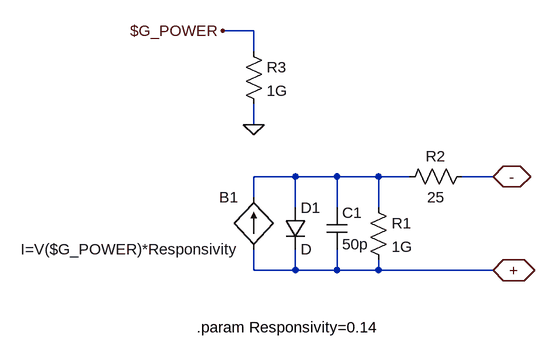
[diagram p0: schematic Photodiode.asc]
Photodiode.asc, the LTspice schematic file:
Version 4
SHEET 1 880 680
WIRE 160 -128 112 -128
WIRE 160 -96 160 -128
WIRE 160 16 160 -16
WIRE 224 96 160 96
WIRE 288 96 224 96
WIRE 352 96 288 96
WIRE 400 96 352 96
WIRE 528 96 480 96
WIRE 160 128 160 96
WIRE 224 144 224 96
WIRE 288 144 288 96
WIRE 352 144 352 96
WIRE 160 240 160 208
WIRE 224 240 224 208
WIRE 224 240 160 240
WIRE 288 240 288 208
WIRE 288 240 224 240
WIRE 352 240 352 224
WIRE 352 240 288 240
WIRE 528 240 352 240
FLAG 528 240 +
IOPIN 528 240 BiDir
FLAG 528 96 -
IOPIN 528 96 BiDir
FLAG 160 16 0
FLAG 112 -128 $G_POWER
SYMBOL bi 160 208 R180
WINDOW 0 24 80 Left 2
WINDOW 3 24 0 Left 2
SYMATTR InstName B1
SYMATTR Value I=V($G_POWER)*Responsivity
SYMBOL cap 272 144 R0
SYMATTR InstName C1
SYMATTR Value 50p
SYMBOL res 336 128 R0
SYMATTR InstName R1
SYMATTR Value 1G
SYMBOL res 384 112 R270
WINDOW 0 32 56 VTop 2
WINDOW 3 0 56 VBottom 2
SYMATTR InstName R2
SYMATTR Value 25
SYMBOL res 144 -112 R0
SYMATTR InstName R3
SYMATTR Value 1G
SYMBOL diode 208 144 R0
SYMATTR InstName D1
TEXT 72 328 Left 2 !.param Responsivity=0.14

The netlist it stands for:
* Photodiode.asc
B1 + N001 I=V($G_POWER)*Responsivity
C1 N001 + 50p
R1 N001 + 1G
R2 N001 - 25
R3 $G_POWER 0 1G
D1 N001 + D
.model D D
.lib standard.dio
.param Responsivity=0.14
.backanno
.end